# Altium project HSBNE-MAIN.PrjPcb
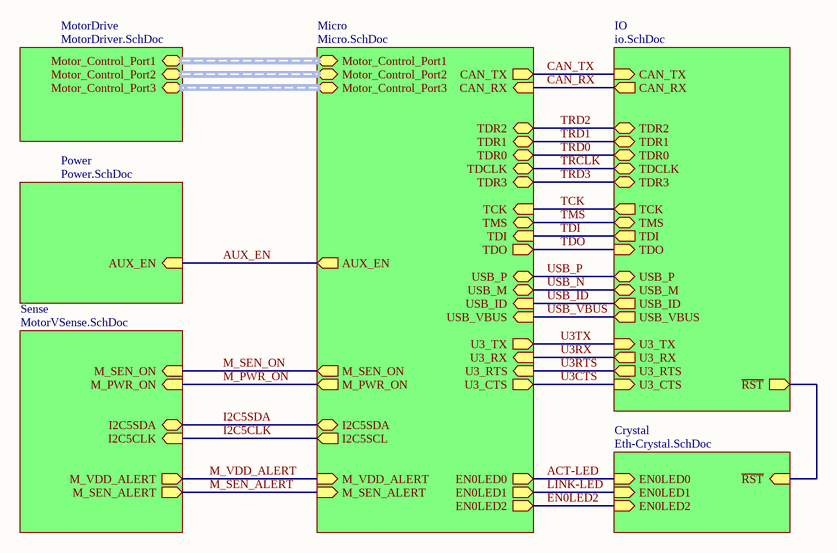
[diagram p0: Main.SchDoc]
7 sheets, 140 parts. Net scope: hierarchical (ports join the sheet entries above them; power ports are global).
Board file: HSBNE-MOTOR.PcbDoc
Sheets:
  Main.SchDoc
    MotorDrive = MotorDriver.SchDoc
    Micro = Micro.SchDoc
    Power = Power.SchDoc
    Crystal = Eth-Crystal.SchDoc
    IO = io.SchDoc
    Sense = MotorVSense.SchDoc

## Sheet Main.SchDoc
size A

### Sub-sheets
Crystal = Eth-Crystal.SchDoc: EN0LED0 (in), EN0LED1 (in), EN0LED2 (in), ~{RST} (in)
IO = io.SchDoc: CAN_TX (in), CAN_RX (out), TCK (out), TMS (bidir), TDI (out), TDO (in), U3_RTS (out), U3_CTS (in), U3_TX (in), U3_RX (out), USB_P (bidir), USB_M (bidir), USB_ID (out), USB_VBUS (out), ~{RST} (out), TDR1 (bidir), TDR0 (bidir), TDR2 (bidir), TDCLK (bidir), TDR3 (bidir)
Micro = Micro.SchDoc: AUX_EN (out), CAN_TX (out), CAN_RX (in), Motor_Control_Port1 (harness MCP), Motor_Control_Port2 (harness MCP), Motor_Control_Port3 (harness MCP), TCK (in), TMS (bidir), TDI (in), TDO (out), EN0LED0 (out), EN0LED1 (out), EN0LED2 (out), USB_P (bidir), USB_M (bidir), USB_ID (in), USB_VBUS (in), M_PWR_ON (out), M_SEN_ON (out), U3_TX (out), U3_RX (in), U3_RTS (in), U3_CTS (out), M_VDD_ALERT (in), M_SEN_ALERT (in), TDR3 (bidir), TDR0 (bidir), TDCLK (bidir), TDR2 (bidir), TDR1 (bidir), I2C5SDA (bidir), I2C5SCL (out)
MotorDrive = MotorDriver.SchDoc: Motor_Control_Port1 (harness MCP), Motor_Control_Port2 (harness MCP), Motor_Control_Port3 (harness MCP)
Power = Power.SchDoc: AUX_EN (in)
Sense = MotorVSense.SchDoc: M_SEN_ON (in), M_PWR_ON (in), I2C5CLK (in), M_VDD_ALERT (out), M_SEN_ALERT (out), I2C5SDA (bidir)

### Nets
ACT-LED: sheet Micro/EN0LED0, sheet Crystal/EN0LED0
AUX_EN: sheet Micro/AUX_EN, sheet Power/AUX_EN
CAN_RX: sheet Micro/CAN_RX, sheet IO/CAN_RX  [project net CAN RX]
CAN_TX: sheet Micro/CAN_TX, sheet IO/CAN_TX  [project net CAN TX]
EN0LED2: sheet Micro/EN0LED2, sheet Crystal/EN0LED2
I2C5CLK: sheet Micro/I2C5SCL, sheet Sense/I2C5CLK
I2C5SDA: sheet Micro/I2C5SDA, sheet Sense/I2C5SDA
LINK-LED: sheet Micro/EN0LED1, sheet Crystal/EN0LED1
M_PWR_ON: sheet Micro/M_PWR_ON, sheet Sense/M_PWR_ON
M_SEN_ALERT: sheet Micro/M_SEN_ALERT, sheet Sense/M_SEN_ALERT
M_SEN_ON: sheet Micro/M_SEN_ON, sheet Sense/M_SEN_ON
M_VDD_ALERT: sheet Micro/M_VDD_ALERT, sheet Sense/M_VDD_ALERT
~{RST}: sheet Crystal/~{RST}, sheet IO/~{RST}
TCK: sheet Micro/TCK, sheet IO/TCK
TDI: sheet Micro/TDI, sheet IO/TDI
TDO: sheet Micro/TDO, sheet IO/TDO
TMS: sheet Micro/TMS, sheet IO/TMS
TRCLK: sheet Micro/TDCLK, sheet IO/TDCLK
TRD0: sheet Micro/TDR0, sheet IO/TDR0
TRD1: sheet Micro/TDR1, sheet IO/TDR1
TRD2: sheet Micro/TDR2, sheet IO/TDR2
TRD3: sheet Micro/TDR3, sheet IO/TDR3
U3CTS: sheet Micro/U3_CTS, sheet IO/U3_CTS
U3RTS: sheet Micro/U3_RTS, sheet IO/U3_RTS
U3RX: sheet Micro/U3_RX, sheet IO/U3_RX
U3TX: sheet Micro/U3_TX, sheet IO/U3_TX
USB_ID: sheet Micro/USB_ID, sheet IO/USB_ID
USB_N: sheet Micro/USB_M, sheet IO/USB_M
USB_P: sheet Micro/USB_P, sheet IO/USB_P
USB_VBUS: sheet Micro/USB_VBUS, sheet IO/USB_VBUS

### Buses and harness runs
harness sheet Micro/Motor_Control_Port1 = sheet MotorDrive/Motor_Control_Port1
harness sheet Micro/Motor_Control_Port2 = sheet MotorDrive/Motor_Control_Port2
harness sheet Micro/Motor_Control_Port3 = sheet MotorDrive/Motor_Control_Port3

## Sheet MotorDriver.SchDoc
size A
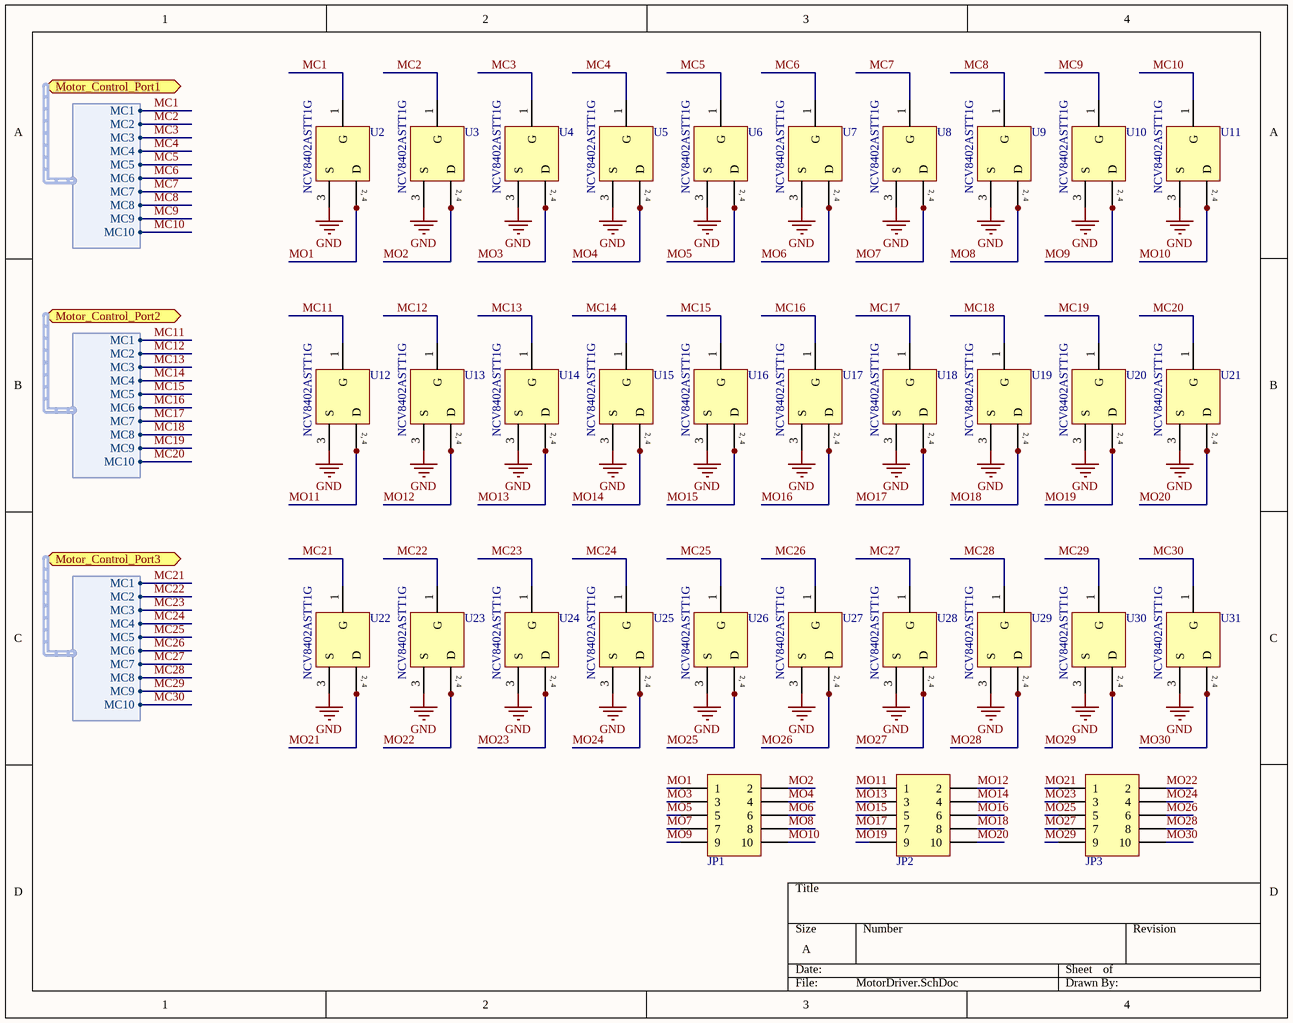
[diagram p1: MotorDriver.SchDoc]

### Parts
JP1  Header 5x2 2.54mm  [2X5]  (value not drawn)
JP2  Header 5x2 2.54mm  [2X5]  (value not drawn)
JP3  Header 5x2 2.54mm  [2X5]  (value not drawn)
U2  NCV8402ASTT1G  [ONSC-SOT-223-4-318E-04_V]
U3  NCV8402ASTT1G  [ONSC-SOT-223-4-318E-04_V]
U4  NCV8402ASTT1G  [ONSC-SOT-223-4-318E-04_V]
U5  NCV8402ASTT1G  [ONSC-SOT-223-4-318E-04_V]
U6  NCV8402ASTT1G  [ONSC-SOT-223-4-318E-04_V]
U7  NCV8402ASTT1G  [ONSC-SOT-223-4-318E-04_V]
U8  NCV8402ASTT1G  [ONSC-SOT-223-4-318E-04_V]
U9  NCV8402ASTT1G  [ONSC-SOT-223-4-318E-04_V]
U10  NCV8402ASTT1G  [ONSC-SOT-223-4-318E-04_V]
U11  NCV8402ASTT1G  [ONSC-SOT-223-4-318E-04_V]
U12  NCV8402ASTT1G  [ONSC-SOT-223-4-318E-04_V]
U13  NCV8402ASTT1G  [ONSC-SOT-223-4-318E-04_V]
U14  NCV8402ASTT1G  [ONSC-SOT-223-4-318E-04_V]
U15  NCV8402ASTT1G  [ONSC-SOT-223-4-318E-04_V]
U16  NCV8402ASTT1G  [ONSC-SOT-223-4-318E-04_V]
U17  NCV8402ASTT1G  [ONSC-SOT-223-4-318E-04_V]
U18  NCV8402ASTT1G  [ONSC-SOT-223-4-318E-04_V]
U19  NCV8402ASTT1G  [ONSC-SOT-223-4-318E-04_V]
U20  NCV8402ASTT1G  [ONSC-SOT-223-4-318E-04_V]
U21  NCV8402ASTT1G  [ONSC-SOT-223-4-318E-04_V]
U22  NCV8402ASTT1G  [ONSC-SOT-223-4-318E-04_V]
U23  NCV8402ASTT1G  [ONSC-SOT-223-4-318E-04_V]
U24  NCV8402ASTT1G  [ONSC-SOT-223-4-318E-04_V]
U25  NCV8402ASTT1G  [ONSC-SOT-223-4-318E-04_V]
U26  NCV8402ASTT1G  [ONSC-SOT-223-4-318E-04_V]
U27  NCV8402ASTT1G  [ONSC-SOT-223-4-318E-04_V]
U28  NCV8402ASTT1G  [ONSC-SOT-223-4-318E-04_V]
U29  NCV8402ASTT1G  [ONSC-SOT-223-4-318E-04_V]
U30  NCV8402ASTT1G  [ONSC-SOT-223-4-318E-04_V]
U31  NCV8402ASTT1G  [ONSC-SOT-223-4-318E-04_V]

### Ports
Motor_Control_Port1 (harness MCP), Motor_Control_Port2 (harness MCP), Motor_Control_Port3 (harness MCP)

### Harnesses
MCP: MC1, MC2, MC3, MC4, MC5, MC6, MC7, MC8, MC9, MC10

### Nets
GND: U2.3(S) U3.3(S) U4.3(S) U5.3(S) U6.3(S) U7.3(S) U8.3(S) U9.3(S) U10.3(S) U11.3(S) U12.3(S) U13.3(S) U14.3(S) U15.3(S) U16.3(S) U17.3(S) U18.3(S) U19.3(S) U20.3(S) U21.3(S) U22.3(S) U23.3(S) U24.3(S) U25.3(S) U26.3(S) U27.3(S) U28.3(S) U29.3(S) U30.3(S) U31.3(S)
MC1: U2.1(G) ; port Motor_Control_Port1.MC1
MC2: U3.1(G) ; port Motor_Control_Port1.MC2
MC3: U4.1(G) ; port Motor_Control_Port1.MC3
MC4: U5.1(G) ; port Motor_Control_Port1.MC4
MC5: U6.1(G) ; port Motor_Control_Port1.MC5
MC6: U7.1(G) ; port Motor_Control_Port1.MC6
MC7: U8.1(G) ; port Motor_Control_Port1.MC7
MC8: U9.1(G) ; port Motor_Control_Port1.MC8
MC9: U10.1(G) ; port Motor_Control_Port1.MC9
MC10: U11.1(G) ; port Motor_Control_Port1.MC10
MC11: U12.1(G) ; port Motor_Control_Port2.MC1
MC12: U13.1(G) ; port Motor_Control_Port2.MC2
MC13: U14.1(G) ; port Motor_Control_Port2.MC3
MC14: U15.1(G) ; port Motor_Control_Port2.MC4
MC15: U16.1(G) ; port Motor_Control_Port2.MC5
MC16: U17.1(G) ; port Motor_Control_Port2.MC6
MC17: U18.1(G) ; port Motor_Control_Port2.MC7
MC18: U19.1(G) ; port Motor_Control_Port2.MC8
MC19: U20.1(G) ; port Motor_Control_Port2.MC9
MC20: U21.1(G) ; port Motor_Control_Port2.MC10
MC21: U22.1(G) ; port Motor_Control_Port3.MC1
MC22: U23.1(G) ; port Motor_Control_Port3.MC2
MC23: U24.1(G) ; port Motor_Control_Port3.MC3
MC24: U25.1(G) ; port Motor_Control_Port3.MC4
MC25: U26.1(G) ; port Motor_Control_Port3.MC5
MC26: U27.1(G) ; port Motor_Control_Port3.MC6
MC27: U28.1(G) ; port Motor_Control_Port3.MC7
MC28: U29.1(G) ; port Motor_Control_Port3.MC8
MC29: U30.1(G) ; port Motor_Control_Port3.MC9
MC30: U31.1(G) ; port Motor_Control_Port3.MC10
MO1: JP1.1 U2.2(D) U2.4(D)
MO2: JP1.2 U3.2(D) U3.4(D)
MO3: JP1.3 U4.2(D) U4.4(D)
MO4: JP1.4 U5.2(D) U5.4(D)
MO5: JP1.5 U6.2(D) U6.4(D)
MO6: JP1.6 U7.2(D) U7.4(D)
MO7: JP1.7 U8.2(D) U8.4(D)
MO8: JP1.8 U9.2(D) U9.4(D)
MO9: JP1.9 U10.2(D) U10.4(D)
MO10: JP1.10 U11.2(D) U11.4(D)
MO11: JP2.1 U12.2(D) U12.4(D)
MO12: JP2.2 U13.2(D) U13.4(D)
MO13: JP2.3 U14.2(D) U14.4(D)
MO14: JP2.4 U15.2(D) U15.4(D)
MO15: JP2.5 U16.2(D) U16.4(D)
MO16: JP2.6 U17.2(D) U17.4(D)
MO17: JP2.7 U18.2(D) U18.4(D)
MO18: JP2.8 U19.2(D) U19.4(D)
MO19: JP2.9 U20.2(D) U20.4(D)
MO20: JP2.10 U21.2(D) U21.4(D)
MO21: JP3.1 U22.2(D) U22.4(D)
MO22: JP3.2 U23.2(D) U23.4(D)
MO23: JP3.3 U24.2(D) U24.4(D)
MO24: JP3.4 U25.2(D) U25.4(D)
MO25: JP3.5 U26.2(D) U26.4(D)
MO26: JP3.6 U27.2(D) U27.4(D)
MO27: JP3.7 U28.2(D) U28.4(D)
MO28: JP3.8 U29.2(D) U29.4(D)
MO29: JP3.9 U30.2(D) U30.4(D)
MO30: JP3.10 U31.2(D) U31.4(D)

### Notes on the sheet
- (in symbol CMP-1069-00019-1) 2, 4

### Library data of the parts
JP1-JP3 = Header 5x2: Header, 8-Pin; Supplier 1: Farnell; Supplier Part Number 1: 1593440
U2-U31 = CMP-1069-00019-1: Self-Protected Low Side Driver with Temperature and Current Limit, 4-Pin SOT-223, Pb-Free, Tape and Reel; Manufacturer: On Semiconductor; Channel Polarity: N Channel; ComponentLink3Description: Package Specification; Packing: Tape and Reel; ComponentLink3URL: http://www.onsemi.com/pub_link/Collateral/318E-04.PDF; ComponentLink1URL: http://www.onsemi.com/; PartNumber: NCV8402ASTT1G; PackageDescription: 4-Pin Small Outline Transistor, Body 6.5 x 3.5 mm, Pitch 2.3 mm; DatasheetVersion: Rev. 8; ComponentLink1Description: Manufacturer URL; Mounting Technology: Surface Mount; PackageVersion: Rev. N, 08/2009; PackageReference: SOT-223-4-318E-04; ComponentLink2URL: http://www.onsemi.com/pub_link/Collateral/NCV8402-D.PDF; ComponentLink2Description: Datasheet; RoHS: Pb-Free

## Sheet Micro.SchDoc
size A
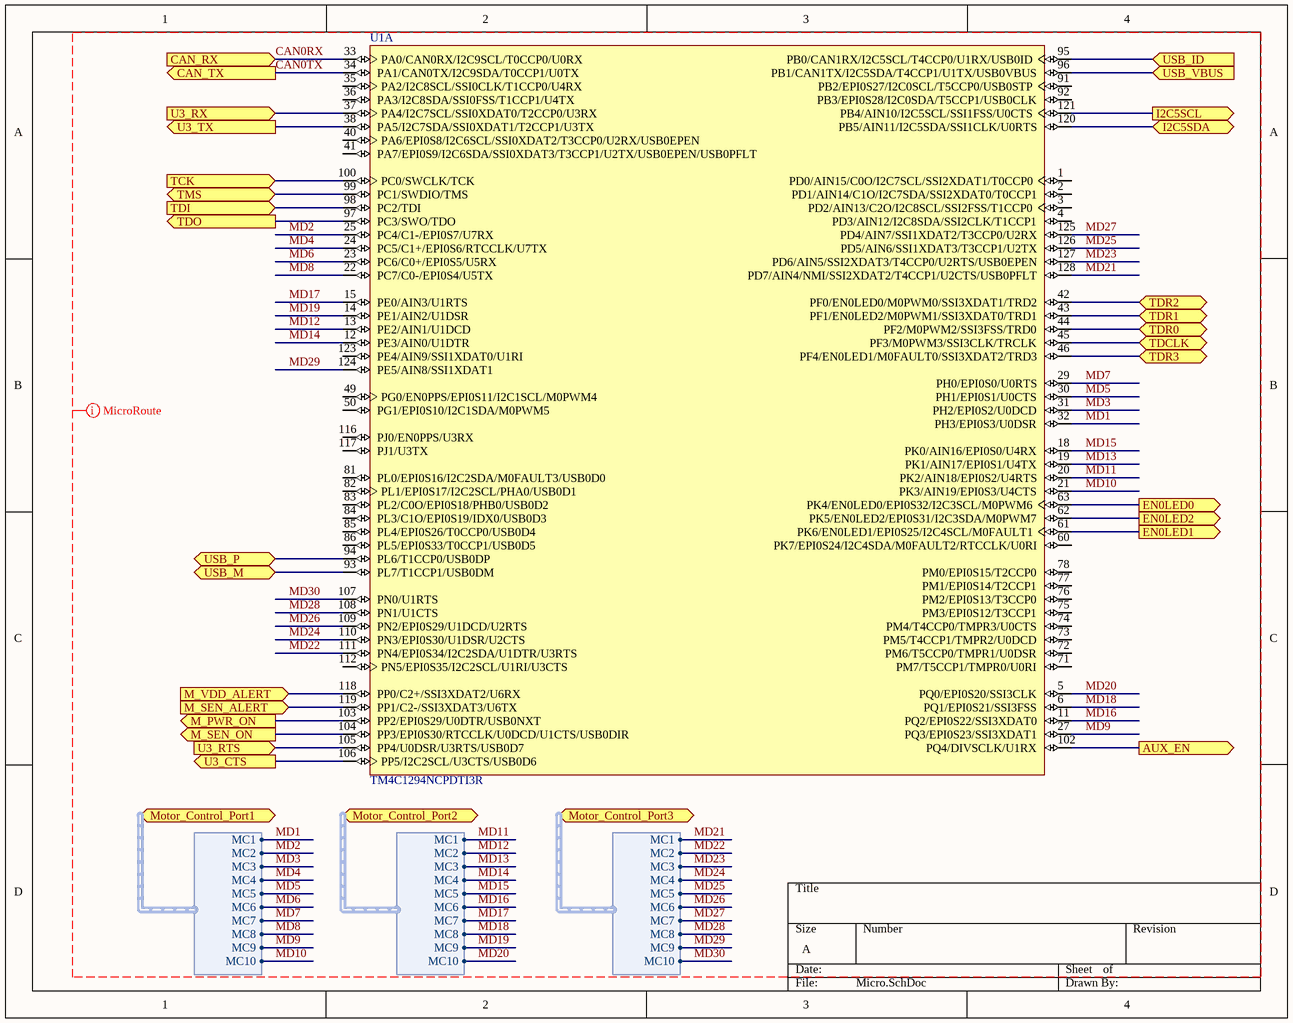
[diagram p2: Micro.SchDoc]

### Parts
U1  TM4C1294NCPDTI3R  [TI-PDT128_M]  (part A of 3)

### Ports
AUX_EN (out), CAN_RX (in), CAN_TX (out), EN0LED0 (out), EN0LED1 (out), EN0LED2 (out), I2C5SCL (out), I2C5SDA (bidir), M_PWR_ON (out), M_SEN_ALERT (in), M_SEN_ON (out), M_VDD_ALERT (in), Motor_Control_Port1 (harness MCP), Motor_Control_Port2 (harness MCP), Motor_Control_Port3 (harness MCP), TCK (in), TDCLK (bidir), TDI (in), TDO (out), TDR0 (bidir), TDR1 (bidir), TDR2 (bidir), TDR3 (bidir), TMS (bidir), U3_CTS (out), U3_RTS (in), U3_RX (in), U3_TX (out), USB_ID (in), USB_M (bidir), USB_P (bidir), USB_VBUS (in)

### Harnesses
MCP: MC1, MC2, MC3, MC4, MC5, MC6, MC7, MC8, MC9, MC10

### Nets
ACT-LED: U1.63(PK4/EN0LED0/EPI0S32/I2C3SCL/M0PWM6) ; port EN0LED0
AUX_EN: U1.102(PQ4/DIVSCLK/U1RX) ; port AUX_EN
CAN0RX: U1.33(PA0/CAN0RX/I2C9SCL/T0CCP0/U0RX) ; port CAN_RX  [project net CAN RX]
CAN0TX: U1.34(PA1/CAN0TX/I2C9SDA/T0CCP1/U0TX) ; port CAN_TX  [project net CAN TX]
EN0LED2: U1.62(PK5/EN0LED2/EPI0S31/I2C3SDA/M0PWM7) ; port EN0LED2
I2C5CLK: U1.121(PB4/AIN10/I2C5SCL/SSI1FSS/U0CTS) ; port I2C5SCL
I2C5SDA: U1.120(PB5/AIN11/I2C5SDA/SSI1CLK/U0RTS) ; port I2C5SDA
LINK-LED: U1.61(PK6/EN0LED1/EPI0S25/I2C4SCL/M0FAULT1) ; port EN0LED1
M_PWR_ON: U1.103(PP2/EPI0S29/U0DTR/USB0NXT) ; port M_PWR_ON
M_SEN_ALERT: U1.119(PP1/C2-/SSI3XDAT3/U6TX) ; port M_SEN_ALERT
M_SEN_ON: U1.104(PP3/EPI0S30/RTCCLK/U0DCD/U1CTS/USB0DIR) ; port M_SEN_ON
M_VDD_ALERT: U1.118(PP0/C2+/SSI3XDAT2/U6RX) ; port M_VDD_ALERT
MD1: U1.32(PH3/EPI0S3/U0DSR) ; port Motor_Control_Port1.MC1  [project net MC1]
MD2: U1.25(PC4/C1-/EPI0S7/U7RX) ; port Motor_Control_Port1.MC2  [project net MC2]
MD3: U1.31(PH2/EPI0S2/U0DCD) ; port Motor_Control_Port1.MC3  [project net MC3]
MD4: U1.24(PC5/C1+/EPI0S6/RTCCLK/U7TX) ; port Motor_Control_Port1.MC4  [project net MC4]
MD5: U1.30(PH1/EPI0S1/U0CTS) ; port Motor_Control_Port1.MC5  [project net MC5]
MD6: U1.23(PC6/C0+/EPI0S5/U5RX) ; port Motor_Control_Port1.MC6  [project net MC6]
MD7: U1.29(PH0/EPI0S0/U0RTS) ; port Motor_Control_Port1.MC7  [project net MC7]
MD8: U1.22(PC7/C0-/EPI0S4/U5TX) ; port Motor_Control_Port1.MC8  [project net MC8]
MD9: U1.27(PQ3/EPI0S23/SSI3XDAT1) ; port Motor_Control_Port1.MC9  [project net MC9]
MD10: U1.21(PK3/AIN19/EPI0S3/U4CTS) ; port Motor_Control_Port1.MC10  [project net MC10]
MD11: U1.20(PK2/AIN18/EPI0S2/U4RTS) ; port Motor_Control_Port2.MC1  [project net MC11]
MD12: U1.13(PE2/AIN1/U1DCD) ; port Motor_Control_Port2.MC2  [project net MC12]
MD13: U1.19(PK1/AIN17/EPI0S1/U4TX) ; port Motor_Control_Port2.MC3  [project net MC13]
MD14: U1.12(PE3/AIN0/U1DTR) ; port Motor_Control_Port2.MC4  [project net MC14]
MD15: U1.18(PK0/AIN16/EPI0S0/U4RX) ; port Motor_Control_Port2.MC5  [project net MC15]
MD16: U1.11(PQ2/EPI0S22/SSI3XDAT0) ; port Motor_Control_Port2.MC6  [project net MC16]
MD17: U1.15(PE0/AIN3/U1RTS) ; port Motor_Control_Port2.MC7  [project net MC17]
MD18: U1.6(PQ1/EPI0S21/SSI3FSS) ; port Motor_Control_Port2.MC8  [project net MC18]
MD19: U1.14(PE1/AIN2/U1DSR) ; port Motor_Control_Port2.MC9  [project net MC19]
MD20: U1.5(PQ0/EPI0S20/SSI3CLK) ; port Motor_Control_Port2.MC10  [project net MC20]
MD21: U1.128(PD7/AIN4/NMI/SSI2XDAT2/T4CCP1/U2CTS/USB0PFLT) ; port Motor_Control_Port3.MC1  [project net MC21]
MD22: U1.111(PN4/EPI0S34/I2C2SDA/U1DTR/U3RTS) ; port Motor_Control_Port3.MC2  [project net MC22]
MD23: U1.127(PD6/AIN5/SSI2XDAT3/T4CCP0/U2RTS/USB0EPEN) ; port Motor_Control_Port3.MC3  [project net MC23]
MD24: U1.110(PN3/EPI0S30/U1DSR/U2CTS) ; port Motor_Control_Port3.MC4  [project net MC24]
MD25: U1.126(PD5/AIN6/SSI1XDAT3/T3CCP1/U2TX) ; port Motor_Control_Port3.MC5  [project net MC25]
MD26: U1.109(PN2/EPI0S29/U1DCD/U2RTS) ; port Motor_Control_Port3.MC6  [project net MC26]
MD27: U1.125(PD4/AIN7/SSI1XDAT2/T3CCP0/U2RX) ; port Motor_Control_Port3.MC7  [project net MC27]
MD28: U1.108(PN1/U1CTS) ; port Motor_Control_Port3.MC8  [project net MC28]
MD29: U1.124(PE5/AIN8/SSI1XDAT1) ; port Motor_Control_Port3.MC9  [project net MC29]
MD30: U1.107(PN0/U1RTS) ; port Motor_Control_Port3.MC10  [project net MC30]
TCK: U1.100(PC0/SWCLK/TCK) ; port TCK
TDI: U1.98(PC2/TDI) ; port TDI
TDO: U1.97(PC3/SWO/TDO) ; port TDO
TMS: U1.99(PC1/SWDIO/TMS) ; port TMS
TRCLK: U1.45(PF3/M0PWM3/SSI3CLK/TRCLK) ; port TDCLK
TRD0: U1.44(PF2/M0PWM2/SSI3FSS/TRD0) ; port TDR0
TRD1: U1.43(PF1/EN0LED2/M0PWM1/SSI3XDAT0/TRD1) ; port TDR1
TRD2: U1.42(PF0/EN0LED0/M0PWM0/SSI3XDAT1/TRD2) ; port TDR2
TRD3: U1.46(PF4/EN0LED1/M0FAULT0/SSI3XDAT2/TRD3) ; port TDR3
U3CTS: U1.106(PP5/I2C2SCL/U3CTS/USB0D6) ; port U3_CTS
U3RTS: U1.105(PP4/U0DSR/U3RTS/USB0D7) ; port U3_RTS
U3RX: U1.37(PA4/I2C7SCL/SSI0XDAT0/T2CCP0/U3RX) ; port U3_RX
U3TX: U1.38(PA5/I2C7SDA/SSI0XDAT1/T2CCP1/U3TX) ; port U3_TX
USB_ID: U1.95(PB0/CAN1RX/I2C5SCL/T4CCP0/U1RX/USB0ID) ; port USB_ID
USB_N: U1.93(PL7/T1CCP1/USB0DM) ; port USB_M
USB_P: U1.94(PL6/T1CCP0/USB0DP) ; port USB_P
USB_VBUS: U1.96(PB1/CAN1TX/I2C5SDA/T4CCP1/U1TX/USB0VBUS) ; port USB_VBUS

Not connected (* = marked no-connect by the designer): U1 1(PD0/AIN15/C0O/I2C7SCL/SSI2XDAT1/T0CCP0) 2(PD1/AIN14/C1O/I2C7SDA/SSI2XDAT0/T0CCP1) 3(PD2/AIN13/C2O/I2C8SCL/SSI2FSS/T1CCP0) 4(PD3/AIN12/I2C8SDA/SSI2CLK/T1CCP1) 35(PA2/I2C8SCL/SSI0CLK/T1CCP0/U4RX) 36(PA3/I2C8SDA/SSI0FSS/T1CCP1/U4TX) 40(PA6/EPI0S8/I2C6SCL/SSI0XDAT2/T3CCP0/U2RX/USB0EPEN) 41(PA7/EPI0S9/I2C6SDA/SSI0XDAT3/T3CCP1/U2TX/USB0EPEN/USB0PFLT) 49(PG0/EN0PPS/EPI0S11/I2C1SCL/M0PWM4) 50(PG1/EPI0S10/I2C1SDA/M0PWM5) 60(PK7/EPI0S24/I2C4SDA/M0FAULT2/RTCCLK/U0RI) 71(PM7/T5CCP1/TMPR0/U0RI) 72(PM6/T5CCP0/TMPR1/U0DSR) 73(PM5/T4CCP1/TMPR2/U0DCD) 74(PM4/T4CCP0/TMPR3/U0CTS) 75(PM3/EPI0S12/T3CCP1) 76(PM2/EPI0S13/T3CCP0) 77(PM1/EPI0S14/T2CCP1) 78(PM0/EPI0S15/T2CCP0) 81(PL0/EPI0S16/I2C2SDA/M0FAULT3/USB0D0) 82(PL1/EPI0S17/I2C2SCL/PHA0/USB0D1) 83(PL2/C0O/EPI0S18/PHB0/USB0D2) 84(PL3/C1O/EPI0S19/IDX0/USB0D3) 85(PL4/EPI0S26/T0CCP0/USB0D4) 86(PL5/EPI0S33/T0CCP1/USB0D5) 91(PB2/EPI0S27/I2C0SCL/T5CCP0/USB0STP) 92(PB3/EPI0S28/I2C0SDA/T5CCP1/USB0CLK) 112(PN5/EPI0S35/I2C2SCL/U1RI/U3CTS) 116(PJ0/EN0PPS/U3RX) 117(PJ1/U3TX) 123(PE4/AIN9/SSI1XDAT0/U1RI)

### Layout directives
rule Undefined; rule Undefined: CAN0RX, CAN0TX, MD1, MD2, MD3, MD4, MD5, MD6, MD7, MD8, MD9, MD10, MD11, MD12, MD13, MD14, MD15, MD16, MD17, MD18, MD19, MD20, MD21, MD22, MD23, MD24, MD25, MD26, MD27, MD28, MD29, MD30

### Library data of the parts
U1 = CMP-0945-00007-1: Tiva C Series Microcontroller, 1024 KB Flash, 256 KB SRAM, 12 Bit, 20 Channels, -40 to 85 degC, 128-Pin TQFP (PDT), Green (RoHS & no Sb/Br), Tape and Reel; Manufacturer: Texas Instruments; SRAM: 256 KB; ADC Resolution: 12 Bits; ADC Channels: 20; Flash: 1024 KB; Max Speed: 120 MHz; CPU: ARM Cortex-M4; Packing: Tape and Reel; Mounting Technology: Surface Mount; Eco-Plan: Green (RoHS & no Sb/Br); ComponentLink1URL: http://www.ti.com/; ComponentLink3Description: Package Specification; ComponentLink2Description: Datasheet; PartNumber: TM4C1294NCPDTI3R; DatasheetVersion: 15863.2743; ComponentLink1Description: Manufacturer URL; ComponentLink3URL: http://www.ti.com/lit/ml/mpqf013/mpqf013.pdf; Temperature Range: -40 to 85 degC; ComponentLink2URL: http://www.ti.com/lit/ds/symlink/tm4c1294ncpdt.pdf; PackageVersion: 4087726/A; PackageDescription: 128-Pin Thin Quad Flat Package, Body 14 x 14 mm, Pitch 0.4 mm

## Sheet Power.SchDoc
size A
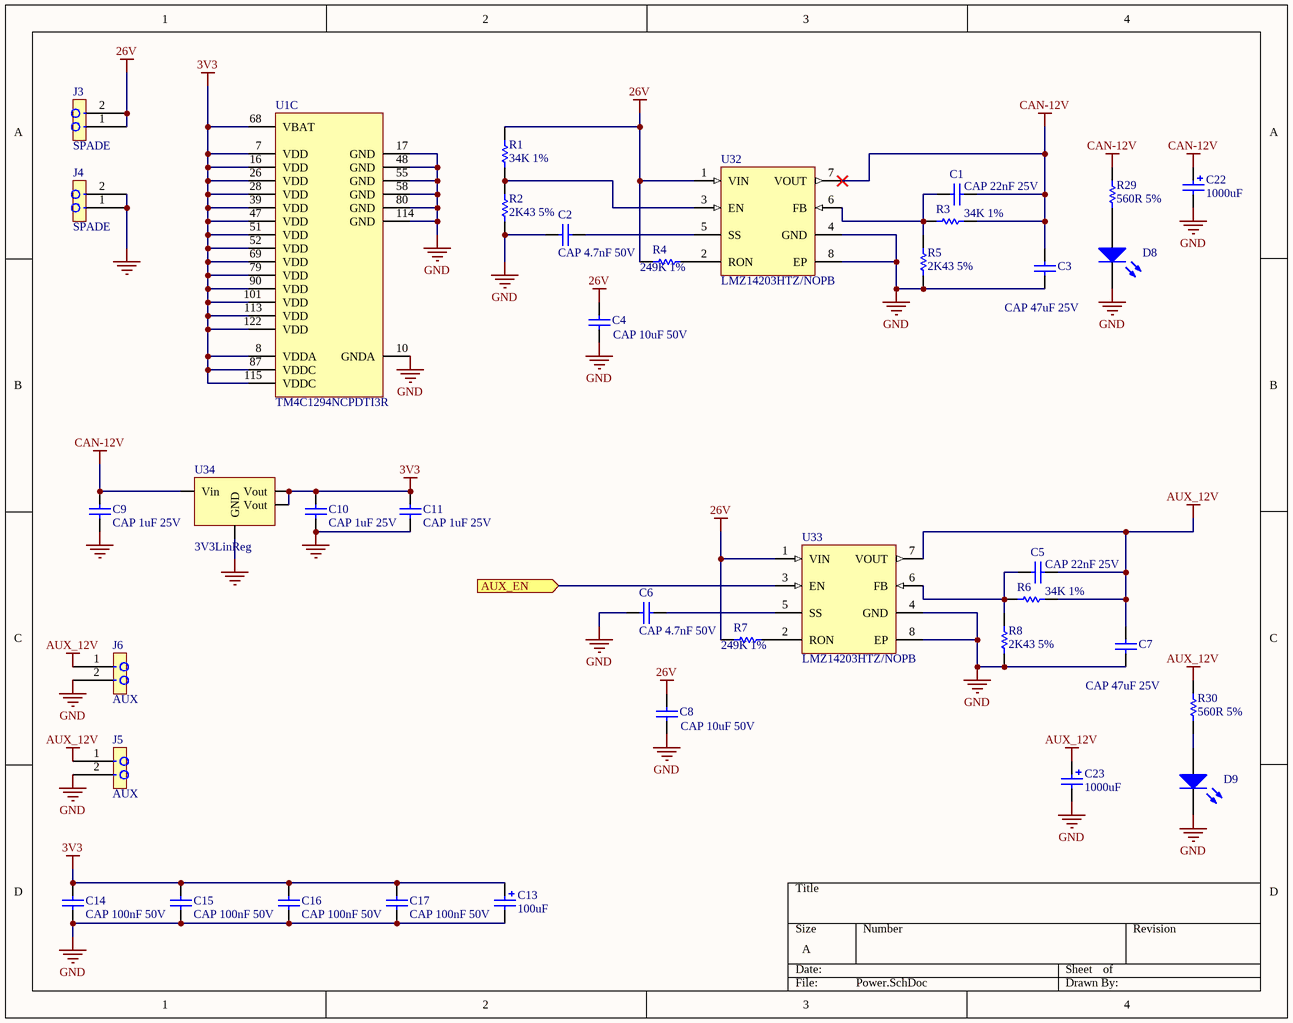
[diagram p3: Power.SchDoc]

### Parts
C1  CAP 22nF 25V  [CAPC0805(2012)100_M]
C2  CAP 4.7nF 50V  [CAPC0603(1608)100_M]
C3  CAP 47uF 25V  [CAPC1206(3216)100_L]
C4  CAP 10uF 50V  [CAPC1206(3216)190_M]
C5  CAP 22nF 25V  [CAPC0805(2012)100_M]
C6  CAP 4.7nF 50V  [CAPC0603(1608)100_M]
C7  CAP 47uF 25V  [CAPC1206(3216)100_L]
C8  CAP 10uF 50V  [CAPC1206(3216)190_M]
C9  CAP 1uF 25V  [CAPC0603(1608)100_M]
C10  CAP 1uF 25V  [CAPC0603(1608)100_M]
C11  CAP 1uF 25V  [CAPC0603(1608)100_M]
C13  100uF  [PANASONIC_C]
C14  CAP 100nF 50V  [CAPC0603(1608)100_M]
C15  CAP 100nF 50V  [CAPC0603(1608)100_M]
C16  CAP 100nF 50V  [CAPC0603(1608)100_M]
C17  CAP 100nF 50V  [CAPC0603(1608)100_M]
C22  1000uF  [PANASONIC_H13]
C23  1000uF  [PANASONIC_H13]
D8  LED  [LED-0603]  (value not drawn)
D9  LED  [LED-0603]  (value not drawn)
J3  SPADE  [SPADE-6.35-RA]
J4  SPADE  [SPADE-6.35-RA]
J5  AUX  [M5569-2]
J6  AUX  [M5569-2]
R1  34K 1%  [RESC0603(1608)_M]
R2  2K43 5%  [RESC0603(1608)_M]
R3  34K 1%  [RESC0603(1608)_M]
R4  249K 1%  [RESC0603(1608)_M]
R5  2K43 5%  [RESC0603(1608)_M]
R6  34K 1%  [RESC0603(1608)_M]
R7  249K 1%  [RESC0603(1608)_M]
R8  2K43 5%  [RESC0603(1608)_M]
R29  560R 5%  [RESC0603(1608)_M]
R30  560R 5%  [RESC0603(1608)_M]
U1  TM4C1294NCPDTI3R  [TI-PDT128_M]  (part C of 3)
U32  LMZ14203HTZ/NOPB  [TZA07A_V]
U33  LMZ14203HTZ/NOPB  [TZA07A_V]
U34  3V3LinReg  [SOT-223]

### Ports
AUX_EN (in)

### Nets
3V3: C10.2 C11.2 C13.+ C14.2 C15.2 C16.2 C17.2 U1.7(VDD) U1.8(VDDA) U1.16(VDD) U1.26(VDD) U1.28(VDD) U1.39(VDD) U1.47(VDD) U1.51(VDD) U1.52(VDD) U1.68(VBAT) U1.69(VDD) U1.79(VDD) U1.87(VDDC) U1.90(VDD) U1.101(VDD) U1.113(VDD) U1.115(VDDC) U1.122(VDD) U34.2(Vout) U34.4(Vout)
26V: C4.1 C8.1 J3.1 J3.2 R1.2 R4.1 R7.1 U32.1(VIN) U33.1(VIN)
AUX_12V: C5.2 C7.1 C23.+ J5.1 J6.1 R6.2 R30.2 U33.7(VOUT)
CAN-12V: C1.2 C3.1 C9.2 C22.+ R3.2 R29.2 U32.7(VOUT) U34.3(Vin)
GND: C2.1 C3.2 C4.2 C6.1 C7.2 C8.2 C9.1 C10.1 C11.1 C13.- C14.1 C15.1 C16.1 C17.1 C22.- C23.- D8.2(K) D9.2(K) J4.1 J4.2 J5.2 J6.2 R2.1 R5.1 R8.1 U1.10(GNDA) U1.17(GND) U1.48(GND) U1.55(GND) U1.58(GND) U1.80(GND) U1.114(GND) U32.4(GND) U32.8(EP) U33.4(GND) U33.8(EP) U34.1(GND)
AUX_EN: U33.3(EN) ; port AUX_EN
NetC1_1: C1.1 R3.1 R5.2 U32.6(FB)
NetC2_2: C2.2 U32.5(SS)
NetC5_1: C5.1 R6.1 R8.2 U33.6(FB)
NetC6_2: C6.2 U33.5(SS)
NetD8_1: D8.1(A) R29.1
NetD9_1: D9.1(A) R30.1
NetR1_1: R1.1 R2.2 U32.3(EN)
NetR4_2: R4.2 U32.2(RON)
NetR7_2: R7.2 U33.2(RON)

### Library data of the parts
C1 C5 = CMP-1036-04051-1: CAP 22nF 25V Â±5% 0805 (2012 Metric) Thickness 1mm SMD; Case-Metric: 2012; Case-EIA: 0805; Technology: SMT; Max Thickness: 1 mm; Value: 22nF; Rated Voltage: 25 V; Tolerance: Â±5%
C2 C6 = CMP-1035-00333-1: CAP 4.7nF 50V Â±20% 0603 (1608 Metric) Thickness 1mm SMD; Case-EIA: 0603; Case-Metric: 1608; Max Thickness: 1 mm; Rated Voltage: 50 V; Technology: SMT; Tolerance: Â±20%; Value: 4.7nF
C3 C7 = CMP-1037-00376-1: CAP 47uF 25V Â±0.25pF 1206 (3216 Metric) Thickness 1mm SMD; Case-EIA: 1206; Case-Metric: 3216; Technology: SMT; Max Thickness: 1 mm; Value: 47uF; Tolerance: Â±0.25pF; Rated Voltage: 25 V
C4 C8 = CMP-1037-04982-1: CAP 10uF 50V Â±10% 1206 (3216 Metric) Thickness 1.9mm SMD; Case-EIA: 1206; Case-Metric: 3216; Technology: SMT; Tolerance: Â±10%; Max Thickness: 1.9 mm; Value: 10uF; Rated Voltage: 50 V
C9-C11 = CMP-1035-00037-1: CAP 1uF 25V Â±0.25pF 0603 (1608 Metric) Thickness 1mm SMD; Case-Metric: 1608; Case-EIA: 0603; Tolerance: Â±0.25pF; Max Thickness: 1 mm; Value: 1uF; Technology: SMT; Rated Voltage: 25 V
C13 = Cap_Polarized_100uF: Polarized Capacitor (Surface Mount); Published: 8-Jun-2000; LatestRevisionDate: 29-May-2009; LatestRevisionNote: IPC-7351 Footprint Added.; PackageReference: C0805; Publisher: Altium Limited; PackageDescription: Chip Capacitor; Value: 100uF; Supplier 1: Digi-Key; Supplier 2: Mouser; Supplier Part Number 1: PCE4718CT-ND; Supplier Part Number 2: 667-EEE-HAJ101WAR
C14-C17 = CMP-1035-00010-1: CAP 100nF 50V Â±0.1pF 0603 (1608 Metric) Thickness 1mm SMD; Case-Metric: 1608; Case-EIA: 0603; Tolerance: Â±0.1pF; Technology: SMT; Value: 100nF; Max Thickness: 1 mm; Rated Voltage: 50 V
C22 C23 = Cap_Polarized_1000uF: Polarized Capacitor (Surface Mount); Published: 8-Jun-2000; LatestRevisionDate: 29-May-2009; LatestRevisionNote: IPC-7351 Footprint Added.; PackageReference: C0805; Publisher: Altium Limited; PackageDescription: Chip Capacitor; Value: 1000uF; Supplier 1: Digi-Key; Supplier 2: Mouser; Supplier Part Number 1: PCE3462CT-ND; Supplier Part Number 2: 140-VE102M1ETR1313
D8 D9 = LED: Typical RED, GREEN, YELLOW, AMBER GaAs LED; Published: 8-Jun-2000; LatestRevisionDate: 17-Jul-2002; LatestRevisionNote: Re-released for DXP Platform.; PackageVersion: Feb-2002; PackageReference: 3.2X1.6X1.1; Publisher: Altium Limited; PackageDescription: SM LED; 2 Flat Leads; Supplier 1: Digi-Key; Supplier 2: Mouser; Supplier Part Number 1: 475-1409-1-ND; Supplier Part Number 2: 720-LGQ971-KN-1
J3-J6 = CON2: 6.35mm right-angle 90° male spade terminal PCB mount; CID: 643; CID2: 643; CID3: 643
R1 R3 R6 = CMP-1012-00682-1: 34K 0.1W 1% 0603 (1608 Metric)  SMD; Value: 34000.00 Ohm; Case-EIA: 0603; Case-Metric: 1608; Tolerance: 1 %; Power: 0.1 W; Technology: SMT
R2 R5 R8 = CMP-1012-00083-1: 2K43 0.1W 5% 0603 (1608 Metric)  SMD; Value: 2430.00 Ohm; Case-Metric: 1608; Case-EIA: 0603; Tolerance: 5 %; Technology: SMT; Power: 0.1 W
R4 R7 = CMP-1012-00779-1: 249K 0.1W 1% 0603 (1608 Metric)  SMD; Case-Metric: 1608; Case-EIA: 0603; Value: 249000.00 Ohm; Technology: SMT; Power: 0.1 W; Tolerance: 1 %
R29 R30 = CMP-1012-00068-1: 560R 0.1W 5% 0603 (1608 Metric)  SMD; Case-EIA: 0603; Case-Metric: 1608; Value: 560.00 Ohm; Tolerance: 5 %; Technology: SMT; Power: 0.1 W
U1 = CMP-0945-00007-1: as U1 on sheet Micro; Packing: Tape and Reel; Mounting Technology: Surface Mount; Eco-Plan: Green (RoHS & no Sb/Br); ComponentLink1URL: http://www.ti.com/; ComponentLink3Description: Package Specification; ComponentLink2Description: Datasheet; PartNumber: TM4C1294NCPDTI3R; DatasheetVersion: 15863.2743; ComponentLink1Description: Manufacturer URL; ComponentLink3URL: http://www.ti.com/lit/ml/mpqf013/mpqf013.pdf; Temperature Range: -40 to 85 degC; ComponentLink2URL: http://www.ti.com/lit/ds/symlink/tm4c1294ncpdt.pdf; PackageVersion: 4087726/A; PackageDescription: 128-Pin Thin Quad Flat Package, Body 14 x 14 mm, Pitch 0.4 mm; PartId: 2
U32 U33 = CMP-0069-02044-1: 3A SIMPLE SWITCHERÂ® Power Module with 42V Maximum Input for High Voltage Output, 7-pin TO-PMOD, Pb-Free, 250 Reel; Manufacturer: National Semiconductor; PowerWise: Y; PackageTopMarking: NSUZXYTTE#*LMZ14203*HTZ; ComponentLink3URL: http://www.national.com/packaging/folders/tza07a.html; ComponentLink2URL: http://www.national.com/pf/LM/LMZ14203H.html; ComponentLink1Description: LMZ14203 Datasheet; PackageVersion: revD, Apr-2011; RoHS: Y; DatasheetVersion: Jan-2011; PinCount: 7; CompType: Switcher; PackageDescription: TO-PMOD-7, 10.16 x 9.85 x 4.57 mm Body, 7 Lead, 1.27mm Pitch, Surface Mount; PackageReference: TZA07A; ComponentLink1URL: http://www.national.com/ds/LM/LMZ14203H.pdf; ComponentLink3Description: TZA07A Package Page; ComponentLink2Description: LMZ14203H Web Page
U34 = AZ1117EH: Reg 1A 3V3 OUT SIP VERT; Supplier 1: Digi-Key; Supplier Part Number 1: AZ1117EH-3.3TRG1DICT-ND

## Sheet Eth-Crystal.SchDoc
size A
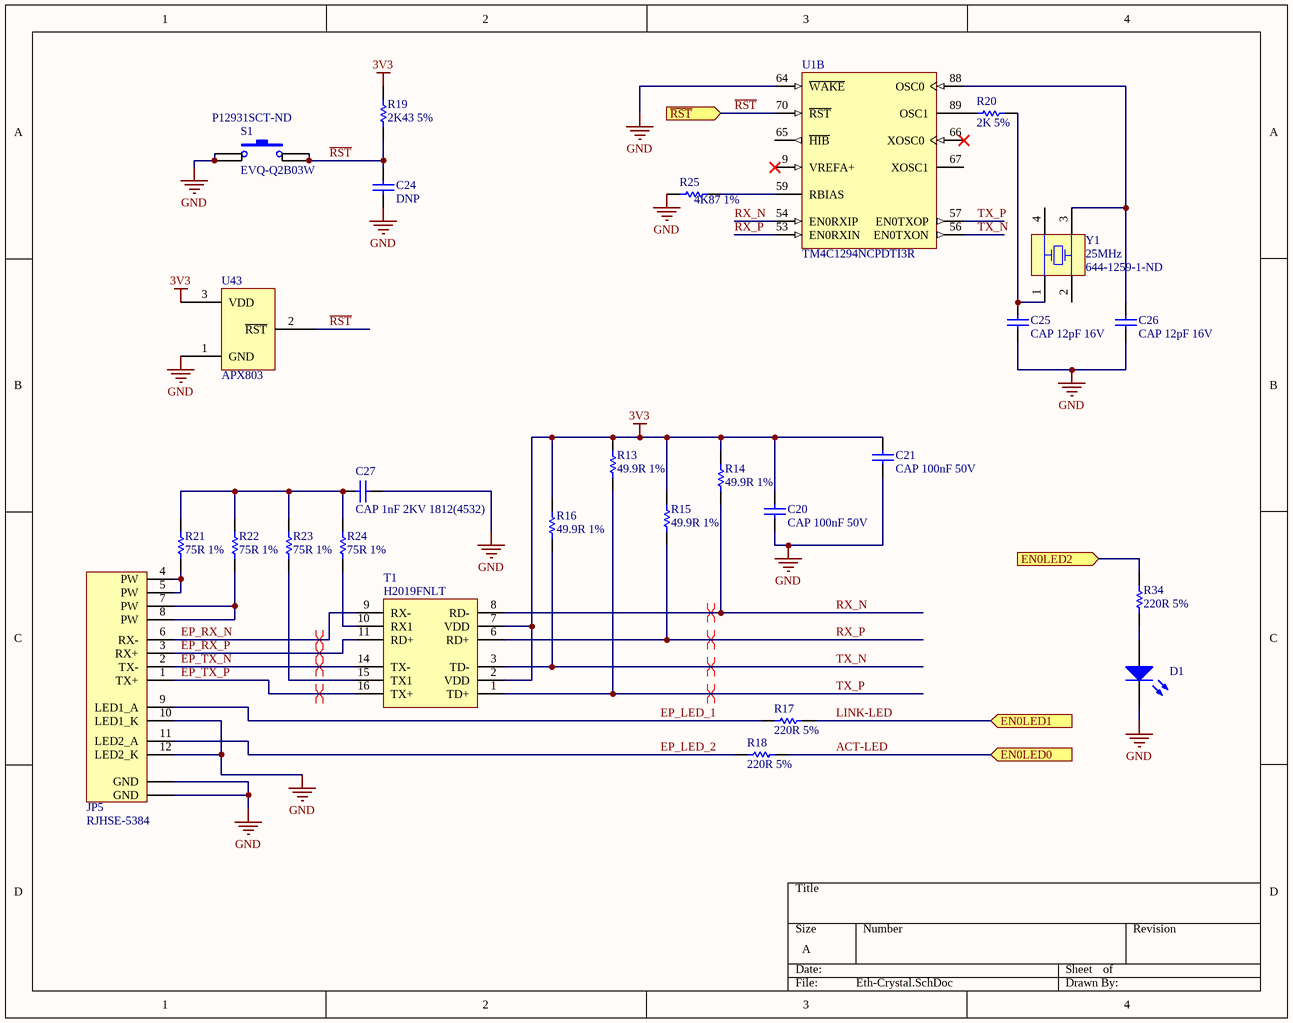
[diagram p4: Eth-Crystal.SchDoc]

### Parts
C20  CAP 100nF 50V  [CAPC0603(1608)100_M]
C21  CAP 100nF 50V  [CAPC0603(1608)100_M]
C24  DNP  [0603]
C25  CAP 12pF 16V  [CAPC0603(1608)100_L]
C26  CAP 12pF 16V  [CAPC0603(1608)100_L]
C27  CAP 1nF 2KV 1812(4532)  [CAPC1812(4532)230_N]
D1  LED  [LED-0603]  (value not drawn)
JP5  RJHSE-5384  [RJHSE-5484]
R13  49.9R 1%  [RESC0603(1608)_M]
R14  49.9R 1%  [RESC0603(1608)_M]
R15  49.9R 1%  [RESC0603(1608)_M]
R16  49.9R 1%  [RESC0603(1608)_M]
R17  220R 5%  [RESC0603(1608)_M]
R18  220R 5%  [RESC0603(1608)_M]
R19  2K43 5%  [RESC0603(1608)_M]
R20  2K 5%  [RESC0603(1608)_N]
R21  75R 1%  [RESC0603(1608)_N]
R22  75R 1%  [RESC0603(1608)_N]
R23  75R 1%  [RESC0603(1608)_N]
R24  75R 1%  [RESC0603(1608)_N]
R25  4K87 1%  [RESC0603(1608)_M]
R34  220R 5%  [RESC0603(1608)_M]
S1  EVQ-Q2B03W  Supplier Part Number 1: P12931SCT-ND  [TACTILE_SWITCH_SMD]
T1  H2019FNLT  [HXXXX]
U1  TM4C1294NCPDTI3R  [TI-PDT128_M]  (part B of 3)
U43  APX803  [SOT-23 - ESD]
Y1  Supplier Part Number 1: 644-1259-1-ND  [Crystal 3.2x2.5]  (hidden comment: 25MHz)

### Ports
EN0LED0 (in), EN0LED1 (in), EN0LED2 (in), ~{RST} (in)

### Nets
3V3: C20.2 C21.2 R13.2 R14.2 R15.2 R16.2 R19.2 T1.2(VDD) T1.7(VDD) U43.3(VDD)
GND: C20.1 C21.1 C24.1 C25.1 C26.1 C27.2 D1.2(K) JP5.10(LED1_K) JP5.12(LED2_K) JP5.GND1(GND) JP5.GND2(GND) R25.1 S1.1 S1.2 U1.64(~{WAKE}) U43.1(GND)
ACT-LED: R18.2 ; port EN0LED0
EN0LED2: R34.2 ; port EN0LED2
EP_LED_1: JP5.9(LED1_A) R17.1
EP_LED_2: JP5.11(LED2_A) R18.1
EP_RX_N: JP5.6(RX-) T1.9(RX-)
EP_RX_P: JP5.3(RX+) T1.11(RD+)
EP_TX_N: JP5.2(TX-) T1.14(TX-)
EP_TX_P: JP5.1(TX+) T1.16(TX+)
LINK-LED: R17.2 ; port EN0LED1
~{RST}: C24.2 R19.1 S1.3 S1.4 U1.70(~{RST}) U43.2(~{RST}) ; port ~{RST}
RX_N: R14.1 T1.8(RD-) U1.54(EN0RXIP)
RX_P: R15.1 T1.6(RD+) U1.53(EN0RXIN)
TX_N: R16.1 T1.3(TD-) U1.56(EN0TXON)
TX_P: R13.1 T1.1(TD+) U1.57(EN0TXOP)
NetC25_2: C25.2 R20.2 Y1.1(OSC1)
NetC26_2: C26.2 U1.88(OSC0) Y1.3(OSC2)
NetC27_1: C27.1 R21.2 R22.2 R23.2 R24.2
NetD1_1: D1.1(A) R34.1
NetJP5_4: JP5.4(PW) JP5.5(PW) R21.1
NetJP5_7: JP5.7(PW) JP5.8(PW) R22.1
NetR20_1: R20.1 U1.89(OSC1)
NetR23_1: R23.1 T1.15(TX1)
NetR24_1: R24.1 T1.10(RX1)
NetR25_2: R25.2 U1.59(RBIAS)

Not connected (* = marked no-connect by the designer): U1 9(VREFA+)* 65(~{HIB}) 66(XOSC0)* 67(XOSC1); Y1 2(OSC2) 4(OSC1)

### Layout directives
differential pair: EP_RX_N, EP_RX_P, EP_TX_N, EP_TX_P, RX_N, RX_P, TX_N, TX_P

### Library data of the parts
C20 C21 = CMP-1035-00010-1: as C14 on sheet Power; Tolerance: Â±0.1pF; Technology: SMT; Value: 100nF; Max Thickness: 1 mm; Rated Voltage: 50 V
C24 = Cap_100pF: 100nF; Published: 8-Jun-2000; LatestRevisionDate: 29-May-2009; LatestRevisionNote: IPC-7351 Footprint Added.; PackageReference: C1206; Publisher: Altium Limited; PackageDescription: Chip Capacitor; Value: 100nF; Supplier 1: Digi-Key; Supplier Part Number 1: 399-1096-1-ND; Supplier 2: Mouser; Supplier Part Number 2: 80-C0603C104K3R
C25 C26 = CMP-1035-00602-1: CAP 12pF 16V Â±0.25pF 0603 (1608 Metric) Thickness 1mm SMD; Case-EIA: 0603; Case-Metric: 1608; Technology: SMT; Value: 12pF; Max Thickness: 1 mm; Rated Voltage: 16 V; Tolerance: Â±0.25pF
C27 = CMP-1040-00330-1: CAP 1nF 2KV Â±10% 1812 (4532 Metric) Thickness 2.3mm SMD; Case-EIA: 1812; Case-Metric: 4532; Technology: SMT; Tolerance: Â±10%; Value: 1nF; Max Thickness: 2.3 mm; Rated Voltage: 2K V
D1 = LED: as D8 on sheet Power; Published: 8-Jun-2000; LatestRevisionDate: 17-Jul-2002; LatestRevisionNote: Re-released for DXP Platform.; PackageVersion: Feb-2002; PackageReference: 3.2X1.6X1.1; Publisher: Altium Limited; PackageDescription: SM LED; 2 Flat Leads; Supplier 1: Digi-Key; Supplier 2: Mouser; Supplier Part Number 1: 475-1409-1-ND; Supplier Part Number 2: 720-LGQ971-KN-1
JP5 = Ethernet Socket: Ethernet Socket RJ45 With Leds; Supplier 1: Digi-Key; Supplier 2: Mouser; Supplier Part Number 1: RJHSE-5384-ND; Supplier Part Number 2: 523-RJHSE-5484
R13-R16 = CMP-1012-00042-1: 49.9R 0.1W 1% 0603 (1608 Metric)  SMD; Tolerance: 5 %; Value: 49.90 Ohm; Case-Metric: 1608; Case-EIA: 0603; Technology: SMT; Power: 0.1 W
R17 R18 R34 = CMP-1012-00058-1: 220R 0.1W 5% 0603 (1608 Metric)  SMD; Case-EIA: 0603; Case-Metric: 1608; Value: 220.00 Ohm; Technology: SMT; Power: 0.1 W; Tolerance: 5 %
R19 = CMP-1012-00083-1: as R2 on sheet Power; Tolerance: 5 %; Technology: SMT; Power: 0.1 W
R20 = CMP-1012-00081-1: 2K 0.1W 5% 0603 (1608 Metric)  SMD; Case-Metric: 1608; Value: 2000.00 Ohm; Case-EIA: 0603; Tolerance: 5 %; Technology: SMT; Power: 0.1 W
R21-R24 = CMP-1012-00047-1: 75R 0.1W 1% 0603 (1608 Metric)  SMD; Case-EIA: 0603; Value: 75.00 Ohm; Case-Metric: 1608; Tolerance: 5 %; Technology: SMT; Power: 0.1 W
R25 = CMP-1012-00090-1: 4K87 0.1W 1% 0603 (1608 Metric)  SMD; Tolerance: 5 %; Case-Metric: 1608; Value: 4K87.00 Ohm; Case-EIA: 0603; Technology: SMT; Power: 0.1 W
S1 = SW-PB: Switch; Published: 24-Mar-1999; LatestRevisionDate: 17-Jul-2002; LatestRevisionNote: Re-released for DXP Platform.; PackageReference: SPST-2; Publisher: Altium Limited; PackageDescription: Switch; 2 Leads; Supplier 1: Digi-Key
T1 = Magnetics: Power over Ethernet Magnetic Module; Published: 24-Mar-1999; LatestRevisionDate: 17-Jul-2002; LatestRevisionNote: Re-released for DXP Platform.; PackageReference: MODULE5B; Publisher: Altium Limited; Supplier 1: Digi-Key; Supplier 2: Mouser; Supplier Part Number 2: 673-H2019FNLT
U1 = CMP-0945-00007-1: as U1 on sheet Micro; Packing: Tape and Reel; Mounting Technology: Surface Mount; Eco-Plan: Green (RoHS & no Sb/Br); ComponentLink1URL: http://www.ti.com/; ComponentLink3Description: Package Specification; ComponentLink2Description: Datasheet; PartNumber: TM4C1294NCPDTI3R; DatasheetVersion: 15863.2743; ComponentLink1Description: Manufacturer URL; ComponentLink3URL: http://www.ti.com/lit/ml/mpqf013/mpqf013.pdf; Temperature Range: -40 to 85 degC; ComponentLink2URL: http://www.ti.com/lit/ds/symlink/tm4c1294ncpdt.pdf; PackageVersion: 4087726/A; PackageDescription: 128-Pin Thin Quad Flat Package, Body 14 x 14 mm, Pitch 0.4 mm; PartId: 2
U43 = APX803: IC MPU RESET CIRC 3.08V SOT23R-3; Supplier 1: Digi-Key; Supplier Part Number 1: APX803-31SRG-7DICT-ND
Y1 = Crystal_25MHz: Surface Mount Quartz Crystal; Note: PCB layout complies with manufacturer's recommendation.; Published: 17-Jul-2002; DatasheetDocument: 28-Aug-2001; PackageDocument: 28-Aug-2001; PackageReference: 91SMX; Publisher: Altium Limited; ComponentLink1Description: Manufacturer Link; ComponentLink1URL: http://www.cmac.com/mt/; ComponentLink2Description: Datasheet; ComponentLink2URL: http://www.cmac.com/mt/databook/crystals/smd/90_91_smx.pdf; Value: 25MHz; Supplier 1: Digi-Key

## Sheet io.SchDoc
size A
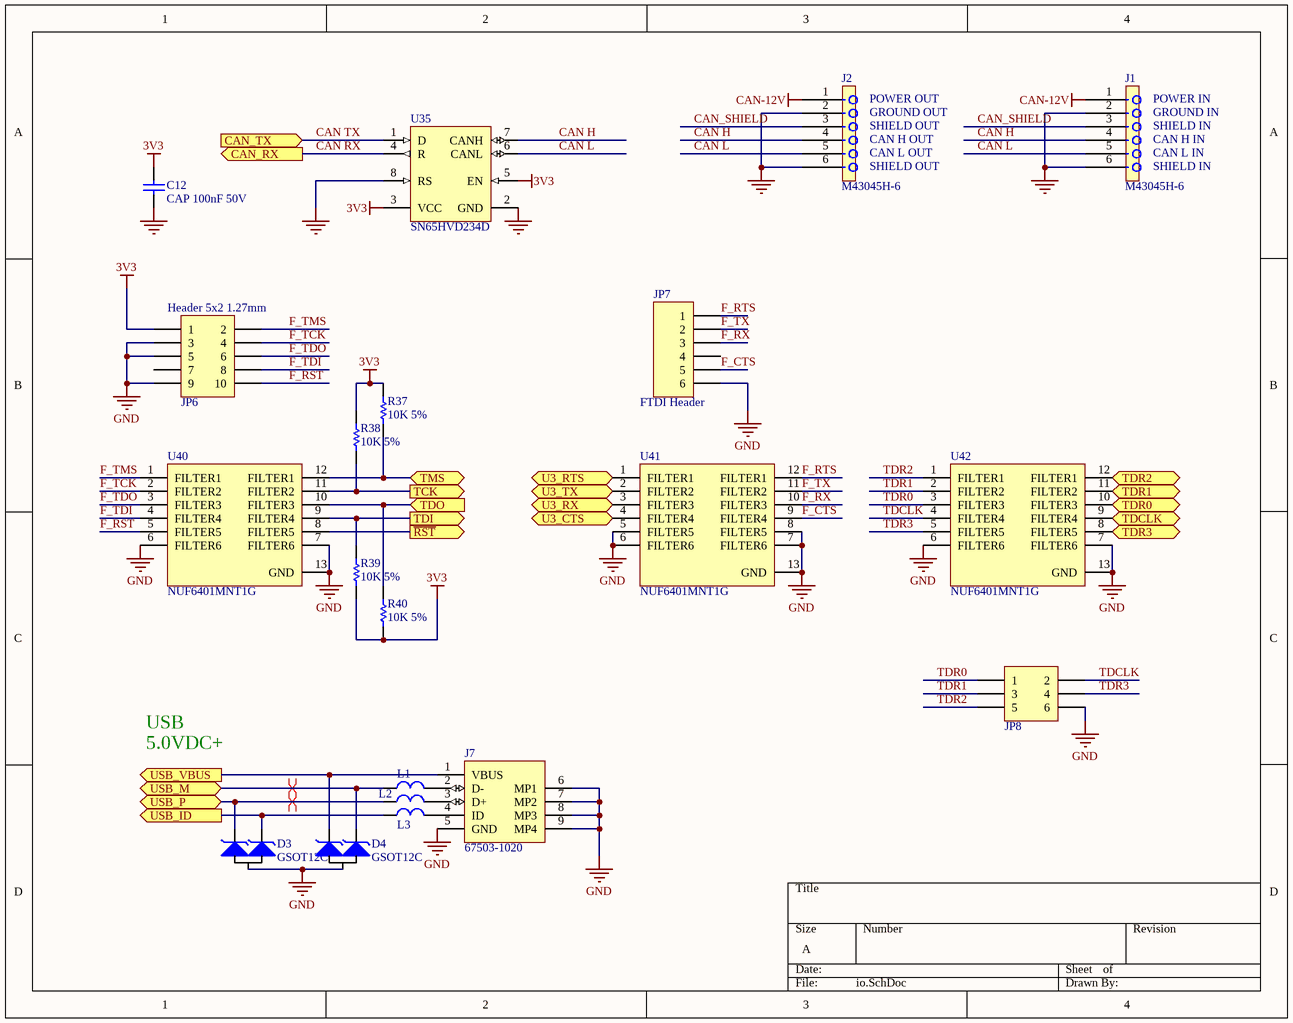
[diagram p5: io.SchDoc]

### Parts
C12  CAP 100nF 50V  [CAPC0603(1608)100_M]
D3  GSOT12C  [SOT-23 - ESD]
D4  GSOT12C  [SOT-23 - ESD]
J1  M43045H-6  [M43045H-6]
J2  M43045H-6  [M43045H-6]
J7  67503-1020  [MOLX-67503-1020_V]
JP6  Header 5x2 1.27mm  [SOP10]
JP7  FTDI Header  [1X6]
JP8  Header 3x2 2.54mm  [2X3]  (value not drawn)
L1  MPZ1608S102A  [0603]  (value not drawn)
L2  MPZ1608S102A  [0603]  (value not drawn)
L3  MPZ1608S102A  [0603]  (value not drawn)
R37  10K 5%  [RESC0603(1608)_N]
R38  10K 5%  [RESC0603(1608)_N]
R39  10K 5%  [RESC0603(1608)_N]
R40  10K 5%  [RESC0603(1608)_N]
U35  SN65HVD234D  [D8_M]
U40  NUF6401MNT1G  [ONSC-DFN-12-506AD-01_V]
U41  NUF6401MNT1G  [ONSC-DFN-12-506AD-01_V]
U42  NUF6401MNT1G  [ONSC-DFN-12-506AD-01_V]

### Ports
CAN_RX (out), CAN_TX (in), TCK (out), TDCLK (bidir), TDI (out), TDO (in), TDR0 (bidir), TDR1 (bidir), TDR2 (bidir), TDR3 (bidir), TMS (bidir), U3_CTS (in), U3_RTS (out), U3_RX (out), U3_TX (in), USB_ID (out), USB_M (bidir), USB_P (bidir), USB_VBUS (out), ~{RST} (out)

### Nets
3V3: C12.2 JP6.1 R37.2 R38.2 R39.1 R40.1 U35.3(VCC) U35.5(EN)
CAN-12V: J1.1 J2.1
GND: C12.1 D3.3(A) D4.3(A) J1.2 J1.6 J2.2 J2.6 J7.5(GND) J7.6(MP1) J7.7(MP2) J7.8(MP3) J7.9(MP4) JP6.3 JP6.5 JP6.9 JP7.6 JP8.6 U35.2(GND) U35.8(RS) U40.6(FILTER6) U40.7(FILTER6) U40.13(GND) U41.5(FILTER5) U41.6(FILTER6) U41.7(FILTER6) U41.8(FILTER5) U41.13(GND) U42.6(FILTER6) U42.7(FILTER6) U42.13(GND)
CAN H: J1.4 J2.4 U35.7(CANH)
CAN L: J1.5 J2.5 U35.6(CANL)
CAN RX: U35.4(R) ; port CAN_RX
CAN TX: U35.1(D) ; port CAN_TX
CAN_SHIELD: J1.3 J2.3
F_CTS: JP7.5 U41.9(FILTER4)
F_~{RST}: JP6.10 U40.5(FILTER5)
F_RTS: JP7.1 U41.12(FILTER1)
F_RX: JP7.3 U41.10(FILTER3)
F_TCK: JP6.4 U40.2(FILTER2)
F_TDI: JP6.8 U40.4(FILTER4)
F_TDO: JP6.6 U40.3(FILTER3)
F_TMS: JP6.2 U40.1(FILTER1)
F_TX: JP7.2 U41.11(FILTER2)
~{RST}: U40.8(FILTER5) ; port ~{RST}
TCK: R38.1 U40.11(FILTER2) ; port TCK
TDCLK: JP8.2 U42.4(FILTER4)
TDI: R39.2 U40.9(FILTER4) ; port TDI
TDO: R40.2 U40.10(FILTER3) ; port TDO
TDR0: JP8.1 U42.3(FILTER3)
TDR1: JP8.3 U42.2(FILTER2)
TDR2: JP8.5 U42.1(FILTER1)
TDR3: JP8.4 U42.5(FILTER5)
TMS: R37.1 U40.12(FILTER1) ; port TMS
TRCLK: U42.9(FILTER4) ; port TDCLK
TRD0: U42.10(FILTER3) ; port TDR0
TRD1: U42.11(FILTER2) ; port TDR1
TRD2: U42.12(FILTER1) ; port TDR2
TRD3: U42.8(FILTER5) ; port TDR3
U3CTS: U41.4(FILTER4) ; port U3_CTS
U3RTS: U41.1(FILTER1) ; port U3_RTS
U3RX: U41.3(FILTER3) ; port U3_RX
U3TX: U41.2(FILTER2) ; port U3_TX
USB_ID: D3.2(K2) L3.1 ; port USB_ID
USB_N: D4.2(K2) L1.1 ; port USB_M
USB_P: D3.1(K1) L2.1 ; port USB_P
USB_VBUS: D4.1(K1) J7.1(VBUS) ; port USB_VBUS
NetJ7_2: J7.2(D-) L1.2
NetJ7_3: J7.3(D+) L2.2
NetJ7_4: J7.4(ID) L3.2

Not connected (* = marked no-connect by the designer): JP6 7; JP7 4

### Layout directives
differential pair: USB_N, USB_P

### Notes on the sheet
- (near J2) POWER OUT
- (near J1) POWER IN
- (near J2) GROUND OUT
- (near J2) SHIELD OUT
- (near J2) CAN H OUT
- (near J2) CAN L OUT
- (near J1) GROUND IN
- (near J1) SHIELD IN
- (near J1) CAN H IN
- (near J1) CAN L IN
- USB
- 5.0VDC+

### Library data of the parts
C12 = CMP-1035-00010-1: as C14 on sheet Power; Tolerance: Â±0.1pF; Technology: SMT; Value: 100nF; Max Thickness: 1 mm; Rated Voltage: 50 V
D3 D4 = 2749: DIO GSOT12C ESD 2LINE 12V SOT23; MPN: GSOT12C-E3-08; COST1K: 0.11250; COST10: 0.3750; COST100: 0.25000; MAN: Vishay Semiconductor Diodes Division; SPN: GSOT12C-E3-08DKR-ND; Supplier: Digi-Key
J1 J2 = CON6: CID: 317
J7 = CMP-0411-00002-1: USB, MINI, SMD, RA KME04-USBMU03A01; Manufacturer: Molex; ComponentLink1URL: http://www.molex.com/; PartNumber: 67503-1020; Mounting Technology: Surface Mount; ComponentLink1Description: Manufacturer URL; Terminal Pitch: 0.8 mm; DatasheetVersion: Rev F, 06/2009; ComponentLink2Description: Datasheet; PackageDescription: Mini USB Connector, SMT, Righer Angle; ComponentLink2URL: http://www.molex.com/pdm_docs/sd/675031020_sd.pdf; PackageReference: 67503-1020
JP6 = Header 5x2: Program; Supplier 1: Digi-Key; Supplier Part Number 1: 1175-1735-ND
JP7 = Header 6: Header, 6-Pin; Supplier 1: Digi-Key; Supplier 2: Mouser; Supplier Part Number 1: 952-2270-ND; Supplier Part Number 2: 538-90120-1086
JP8 = Header 3x2: Header, 6-Pin; Supplier 1: Digi-Key; Supplier 2: Mouser; Supplier Part Number 1: 952-1788-ND; Supplier Part Number 2: 855-M20-9980446
L1-L3 = 2982: IND FERRITE CHIP BEAD 1000 OHM @ 100MHz 800mA 0603; COST1K: 0.02717; COST10: 0.0790; COST100: 0.04720; MAN: TDK Corporation; SPN: 445-8694-6-ND; MPN: MPZ1608S102A; Supplier: Digi-Key
R37-R40 = CMP-1012-00098-1: 10K 0.1W 5% 0603 (1608 Metric)  SMD; Case-EIA: 0603; Value: 10000.00 Ohm; Case-Metric: 1608; Technology: SMT; Tolerance: 5 %; Power: 0.1 W
U35 = CMP-0315-00083-1: 3.3V CAN Transceiver with Sleep Mode, 6 mA, -40 to 125 degC, 8-pin SOIC (D), Green (RoHS & no Sb/Br); Manufacturer: Texas Instruments; Receivers Per Package: 1; ICC(Max)(mA): 6; Bus Fault Voltage(V): +/-30; Supply Voltage(s)(V): 3.3; Rating: Catalog; Transient Pulse Protection(V): -100 to 100; PartNumber: SN65HVD234D; SubFamily: CAN; DatasheetVersion: SLLS557F; Mounting Technology: Surface Mount; Eco-Plan: Green (RoHS & no Sb/Br); PackageVersion: revM, Jun-2011; PackageReference: D8; ComponentLink1Description: Datasheet; Drivers Per Package: 1; Isolated: No; ComponentLink1URL: http://www.ti.com/general/docs/lit/getliterature.tsp?genericPartNumber=SN65HVD234&fileType=pdf; PackageDescription: 8-Pin Plastic Small Outline Integrated Circuit, 4.9 x 3.9 mm, Pitch 1.27 mm Pitch; Code_JEDEC: MS-012AA; Low Power Mode: Sleep; Footprint: PCA82C250, excludes pin5
U40-U42 = CMP-1066-00005-1: 6-Channel EMI Filter with Integrated ESD Protection, -40 to 105 degC, 12-Pin DFN, Pb-Free, Tape and Reel; Manufacturer: On Semiconductor; Number of Lines: 6; VRWM Max (V): 5; V(BR) Typ (V): 7; PackageReference: DFN-12-506AD-01; PartNumber: NUF6401MNT1G; ComponentLink3Description: Package Specification; RoHS: Pb-Free; Mounting Technology: Surface Mount; ComponentLink2Description: Datasheet; ComponentLink1Description: Manufacturer URL; PackageDescription: 12-Pin Small Outline No-Lead, Body 3 x 1.35 mm, Pitch 0.5 mm; Packing: Tape and Reel; DatasheetVersion: Rev. 2; ComponentLink2URL: http://www.onsemi.com/pub_link/Collateral/NUF6401-D.PDF; PackageVersion: Rev. J, 07/2008; ComponentLink3URL: http://www.onsemi.com/pub_link/Collateral/506AD.PDF; ComponentLink1URL: http://www.onsemi.com/; Supplier 1: Digi-Key; Supplier Part Number 1: NUF6401MNT1GOSCT-ND

## Sheet MotorVSense.SchDoc
size A
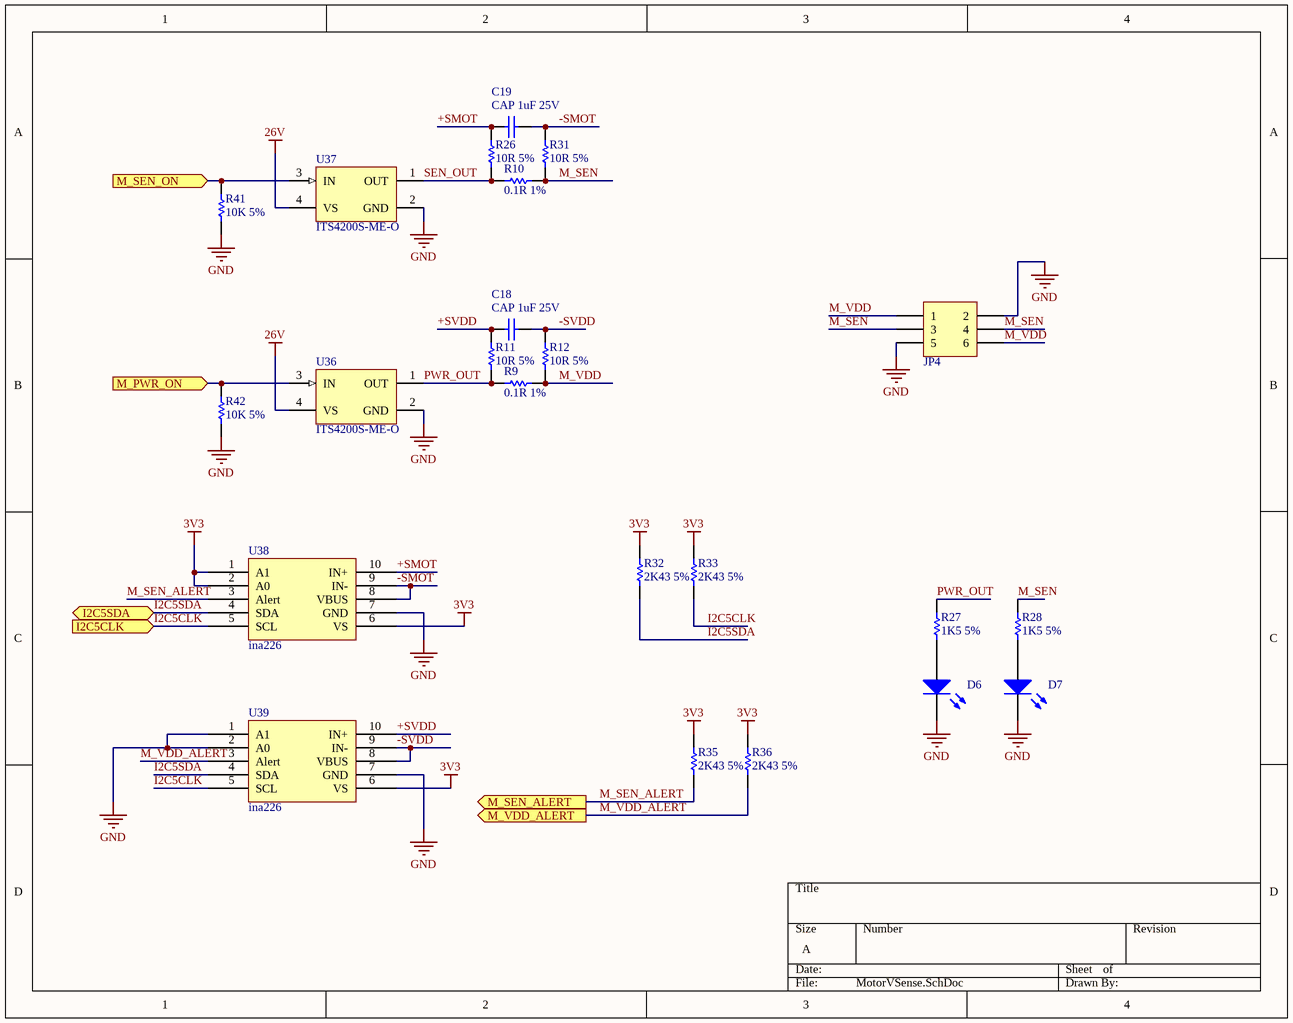
[diagram p6: MotorVSense.SchDoc]

### Parts
C18  CAP 1uF 25V  [CAPC0603(1608)100_M]
C19  CAP 1uF 25V  [CAPC0603(1608)100_M]
D6  LED  [LED-0603]  (value not drawn)
D7  LED  [LED-0603]  (value not drawn)
JP4  Header 3x2 2.54mm  [2X3]  (value not drawn)
R9  0.1R 1%  [RESC2010(5025)_M]
R10  0.1R 1%  [RESC2010(5025)_M]
R11  10R 5%  [RESC0603(1608)_M]
R12  10R 5%  [RESC0603(1608)_M]
R26  10R 5%  [RESC0603(1608)_M]
R27  1K5 5%  [RESC0603(1608)_M]
R28  1K5 5%  [RESC0603(1608)_M]
R31  10R 5%  [RESC0603(1608)_M]
R32  2K43 5%  [RESC0603(1608)_M]
R33  2K43 5%  [RESC0603(1608)_M]
R35  2K43 5%  [RESC0603(1608)_M]
R36  2K43 5%  [RESC0603(1608)_M]
R41  10K 5%  [RESC0603(1608)_N]
R42  10K 5%  [RESC0603(1608)_M]
U36  ITS4200S-ME-O  [INF-SOT223_M]
U37  ITS4200S-ME-O  [INF-SOT223_M]
U38  ina226  [SP10]
U39  ina226  [SP10]

### Ports
I2C5CLK (in), I2C5SDA (bidir), M_PWR_ON (in), M_SEN_ALERT (out), M_SEN_ON (in), M_VDD_ALERT (out)

### Nets
3V3: R32.2 R33.2 R35.2 R36.2 U38.1(A1) U38.2(A0) U38.6(VS) U39.6(VS)
26V: U36.4(VS) U37.4(VS)
GND: D6.2(K) D7.2(K) JP4.2 JP4.5 R41.1 R42.1 U36.2(GND) U37.2(GND) U38.7(GND) U39.1(A1) U39.2(A0) U39.7(GND)
+SMOT: C19.2 R26.2 U38.10(IN+)
+SVDD: C18.2 R11.2 U39.10(IN+)
-SMOT: C19.1 R31.2 U38.8(VBUS) U38.9(IN-)
-SVDD: C18.1 R12.2 U39.8(VBUS) U39.9(IN-)
I2C5CLK: R33.1 U38.5(SCL) U39.5(SCL) ; port I2C5CLK
I2C5SDA: R32.1 U38.4(SDA) U39.4(SDA) ; port I2C5SDA
M_PWR_ON: R42.2 U36.3(IN) ; port M_PWR_ON
M_SEN: JP4.3 JP4.4 R10.2 R28.2 R31.1
M_SEN_ALERT: R35.1 U38.3(Alert) ; port M_SEN_ALERT
M_SEN_ON: R41.2 U37.3(IN) ; port M_SEN_ON
M_VDD: JP4.1 JP4.6 R9.2 R12.1
M_VDD_ALERT: R36.1 U39.3(Alert) ; port M_VDD_ALERT
PWR_OUT: R9.1 R11.1 R27.2 U36.1(OUT)
SEN_OUT: R10.1 R26.1 U37.1(OUT)
NetD6_1: D6.1(A) R27.1
NetD7_1: D7.1(A) R28.1

### Library data of the parts
C18 C19 = CMP-1035-00037-1: as C9 on sheet Power; Tolerance: Â±0.25pF; Max Thickness: 1 mm; Value: 1uF; Technology: SMT; Rated Voltage: 25 V
D6 D7 = LED: as D8 on sheet Power; Published: 8-Jun-2000; LatestRevisionDate: 17-Jul-2002; LatestRevisionNote: Re-released for DXP Platform.; PackageVersion: Feb-2002; PackageReference: 3.2X1.6X1.1; Publisher: Altium Limited; PackageDescription: SM LED; 2 Flat Leads; Supplier 1: Digi-Key; Supplier 2: Mouser; Supplier Part Number 1: 475-1409-1-ND; Supplier Part Number 2: 720-LGQ971-KN-1
JP4 = Header 3x2: Header, 6-Pin; Supplier 1: Digi-Key; Supplier 2: Mouser; Supplier Part Number 1: 952-1788-ND; Supplier Part Number 2: 855-M20-9980446
R9 R10 = CMP-1017-00001-1: 0.1R 2010 1%; Case-Metric: 5025; Value: 0.10 Ohm; Case-EIA: 2010; Tolerance: None; Technology: SMT; Power: None
R11 R12 R26 R31 = CMP-1012-00026-1: 10R 0.1W 5% 0603 (1608 Metric)  SMD; Case-Metric: 1608; Case-EIA: 0603; Value: 10.00 Ohm; Technology: SMT; Tolerance: 5 %; Power: 0.1 W
R27 R28 = CMP-1012-00078-1: 1K5 0.1W 5% 0603 (1608 Metric)  SMD; Case-Metric: 1608; Case-EIA: 0603; Value: 1500.00 Ohm; Technology: SMT; Power: 0.1 W; Tolerance: 5 %
R32 R33 R35 R36 = CMP-1012-00083-1: as R2 on sheet Power; Tolerance: 5 %; Technology: SMT; Power: 0.1 W
R41 R42 = CMP-1012-00098-1: as R37 on sheet io; Technology: SMT; Tolerance: 5 %; Power: 0.1 W
U36 U37 = CMP-1095-00143-1: Smart High-Side NMOS-Power Switch, 11 to 45 V Operating, -40 to 125 degC, SOT223, Reel, Green; Manufacturer: Infineon; Channels: 1; IL (nom)min - one channel active: 0.7Â A; Green: TRUE; Operating Voltage Range (min): 11 V; RON (max) @ Tj max: 320 mOhm; Operating Voltage Range (max): 45 V; Ptot (max): 1.4Â W; toff (max): 150 us; RON @ 25 degC: 200 mOhm (max); IL (SCp): 1.4Â A; IL (SC): 1.1Â A; ton (max): 100 us; Packing: Reel; IL (nom)min - all channels active: 0.7Â A; ComponentLink2Description: Datasheet; Load Current (typ): 0.7Â A; ComponentLink1Description: Manufacturer URL; PackageDescription: 4-Pin Small Outline Transistor Package, 6.5 x 3.5 mm Body, 2.3 mm Pitch; Mounting Technology: Surface Mount; ComponentLink1URL: http://www.infineon.com/; ComponentLink2URL: http://www.infineon.com/dgdl/ITS4200S-ME-O_01092012S.pdf?folderId=db3a304412b407950112b408e8c90004&fileId=db3a304339dcf4b1013a013fb7455740; ComponentLink3URL: http://www.infineon.com/dgdl/SOT223-Package_Overview.pdf?folderId=db3a30431936bc4b0119530470b03c3d&fileId=db3a30431936bc4b0119531d40b93c5c; PackageReference: SOT223; ComponentLink3Description: Package Specification; PartNumber: ITS4200S-ME-O; DatasheetVersion: Rev. 1.0; PackageVersion: Apr-08
U38 U39 = ina226: Supplier 1: Digi-Key; Supplier Part Number 1: 296-29034-1-ND

## Nets that join several sheets
3V3: Power (27 pins), Eth-Crystal (10 pins), io (8 pins), MotorVSense (8 pins)
26V: Power (9 pins), MotorVSense (U36.4 U37.4)
CAN-12V: Power (8 pins), io (J1.1 J2.1)
GND: MotorDriver (30 pins), Power (37 pins), Eth-Crystal (16 pins), io (30 pins), MotorVSense (12 pins)
ACT-LED: Micro (U1.63), Eth-Crystal (R18.2)
AUX_EN: Micro (U1.102), Power (U33.3)
CAN RX: Micro (U1.33), io (U35.4)
CAN TX: Micro (U1.34), io (U35.1)
EN0LED2: Micro (U1.62), Eth-Crystal (R34.2)
I2C5CLK: Micro (U1.121), MotorVSense (R33.1 U38.5 U39.5)
I2C5SDA: Micro (U1.120), MotorVSense (R32.1 U38.4 U39.4)
LINK-LED: Micro (U1.61), Eth-Crystal (R17.2)
M_PWR_ON: Micro (U1.103), MotorVSense (R42.2 U36.3)
M_SEN_ALERT: Micro (U1.119), MotorVSense (R35.1 U38.3)
M_SEN_ON: Micro (U1.104), MotorVSense (R41.2 U37.3)
M_VDD_ALERT: Micro (U1.118), MotorVSense (R36.1 U39.3)
MC1: MotorDriver (U2.1), Micro (U1.32)
MC2: MotorDriver (U3.1), Micro (U1.25)
MC3: MotorDriver (U4.1), Micro (U1.31)
MC4: MotorDriver (U5.1), Micro (U1.24)
MC5: MotorDriver (U6.1), Micro (U1.30)
MC6: MotorDriver (U7.1), Micro (U1.23)
MC7: MotorDriver (U8.1), Micro (U1.29)
MC8: MotorDriver (U9.1), Micro (U1.22)
MC9: MotorDriver (U10.1), Micro (U1.27)
MC10: MotorDriver (U11.1), Micro (U1.21)
MC11: MotorDriver (U12.1), Micro (U1.20)
MC12: MotorDriver (U13.1), Micro (U1.13)
MC13: MotorDriver (U14.1), Micro (U1.19)
MC14: MotorDriver (U15.1), Micro (U1.12)
MC15: MotorDriver (U16.1), Micro (U1.18)
MC16: MotorDriver (U17.1), Micro (U1.11)
MC17: MotorDriver (U18.1), Micro (U1.15)
MC18: MotorDriver (U19.1), Micro (U1.6)
MC19: MotorDriver (U20.1), Micro (U1.14)
MC20: MotorDriver (U21.1), Micro (U1.5)
MC21: MotorDriver (U22.1), Micro (U1.128)
MC22: MotorDriver (U23.1), Micro (U1.111)
MC23: MotorDriver (U24.1), Micro (U1.127)
MC24: MotorDriver (U25.1), Micro (U1.110)
MC25: MotorDriver (U26.1), Micro (U1.126)
MC26: MotorDriver (U27.1), Micro (U1.109)
MC27: MotorDriver (U28.1), Micro (U1.125)
MC28: MotorDriver (U29.1), Micro (U1.108)
MC29: MotorDriver (U30.1), Micro (U1.124)
MC30: MotorDriver (U31.1), Micro (U1.107)
~{RST}: Eth-Crystal (6 pins), io (U40.8)
TCK: Micro (U1.100), io (R38.1 U40.11)
TDI: Micro (U1.98), io (R39.2 U40.9)
TDO: Micro (U1.97), io (R40.2 U40.10)
TMS: Micro (U1.99), io (R37.1 U40.12)
TRCLK: Micro (U1.45), io (U42.9)
TRD0: Micro (U1.44), io (U42.10)
TRD1: Micro (U1.43), io (U42.11)
TRD2: Micro (U1.42), io (U42.12)
TRD3: Micro (U1.46), io (U42.8)
U3CTS: Micro (U1.106), io (U41.4)
U3RTS: Micro (U1.105), io (U41.1)
U3RX: Micro (U1.37), io (U41.3)
U3TX: Micro (U1.38), io (U41.2)
USB_ID: Micro (U1.95), io (D3.2 L3.1)
USB_N: Micro (U1.93), io (D4.2 L1.1)
USB_P: Micro (U1.94), io (D3.1 L2.1)
USB_VBUS: Micro (U1.96), io (D4.1 J7.1)

## Assembly variants
FBOM: not fitted C24